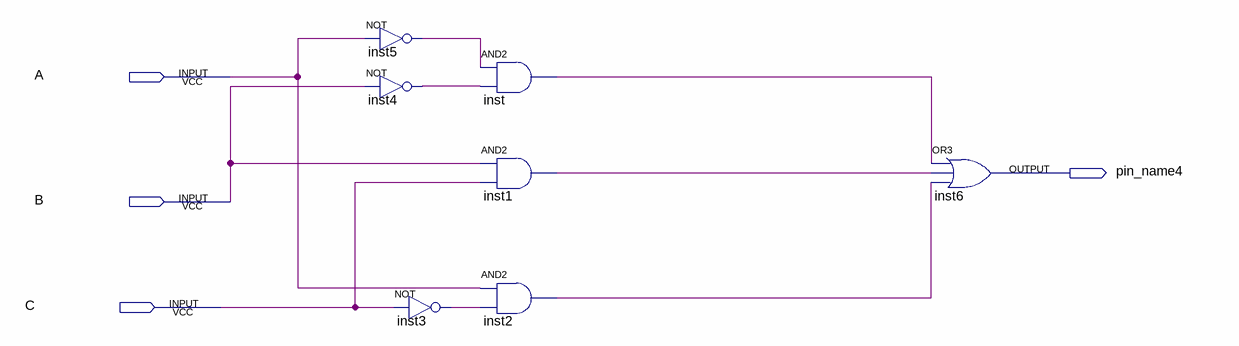
[diagram p0: schematic sheet]
// Quartus schematic labstep2.bdf as structural Verilog: 7 symbols, 4 pins
module labstep2 (
  input  A,
  input  B,
  input  C,
  output pin_name4
);

  wire inst1_out, inst2_out, inst3_out, inst4_out, inst5_out, inst_out;

  not inst5 (inst5_out, A);
  not inst4 (inst4_out, B);
  not inst3 (inst3_out, C);
  and inst (inst_out, inst5_out, inst4_out);
  and inst1 (inst1_out, B, C);
  and inst2 (inst2_out, A, inst3_out);
  or inst6 (pin_name4, inst_out, inst1_out, inst2_out);
endmodule
